# EAGLE schematic Main-DCDC Only (EAGLE 9.4.2)

## Sheet 1 of 2: Filter EMI PMP20694
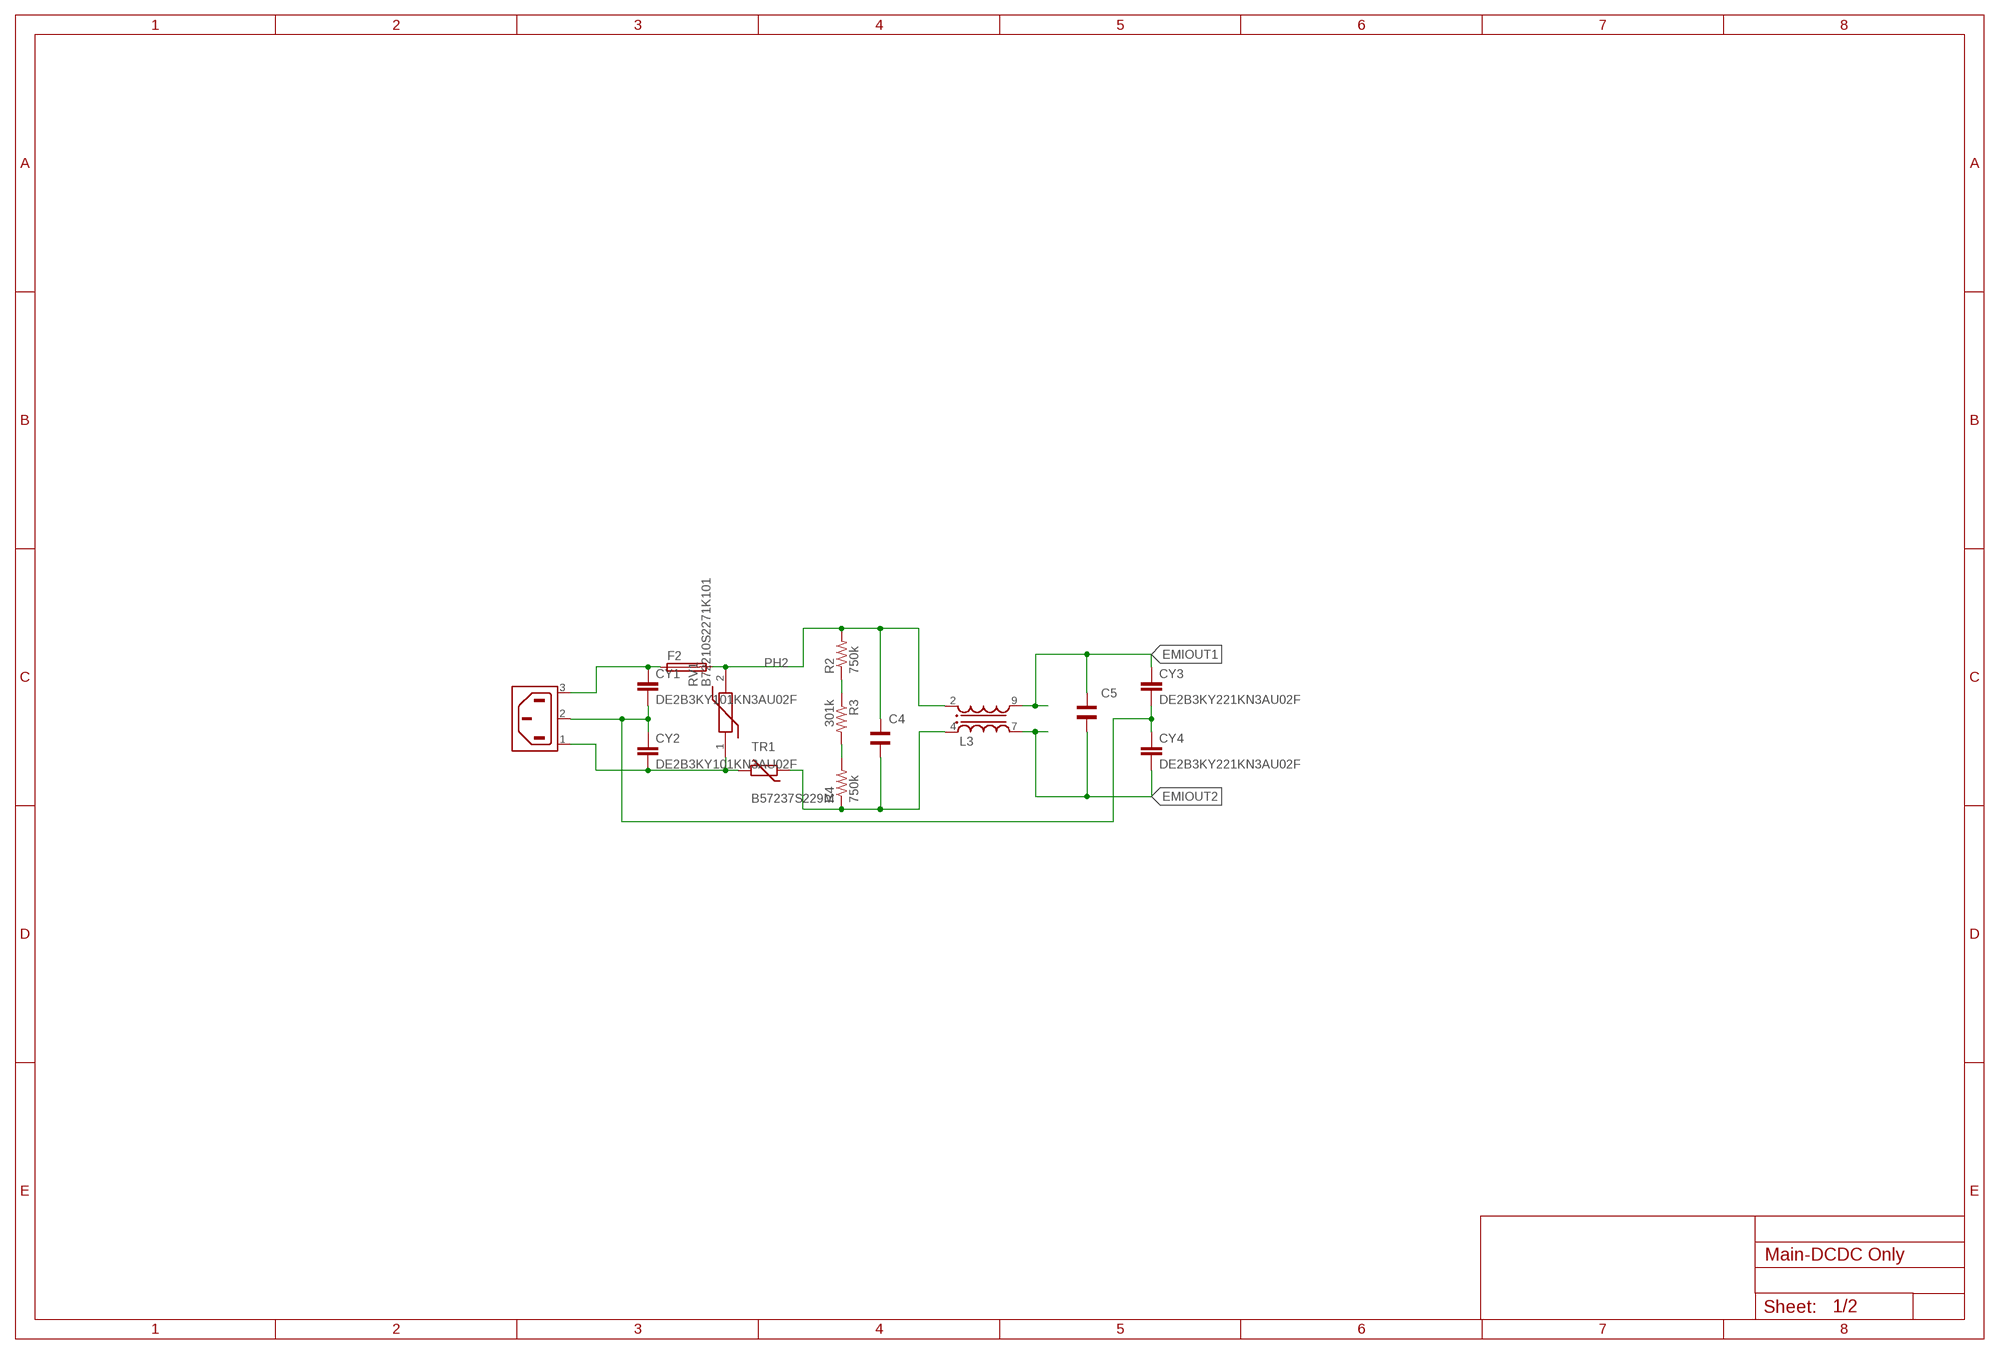
[diagram p0: schematic, sheet 1]

### Parts
C4  WCAP-FTXX_890334025039CS  [WCAP-FTXX_15X18X14X8]
C5  WCAP-FTXX_890334025039CS  [WCAP-FTXX_15X18X14X8]
CY1  DE2B3KY101KN3AU02F  CYYC7B5  [YC7B5]
CY2  DE2B3KY101KN3AU02F  CYYC7B5  [YC7B5]
CY3  DE2B3KY221KN3AU02F  CYYC7B5  [YC7B5]
CY4  DE2B3KY221KN3AU02F  CYYC7B5  [YC7B5]
F2  GSH15  [GSH15]
L3  WE-CMB_L_744824310  [WE-CMB_L]
R2  750k  R-US_R1206  [R1206]
R3  301k  R-US_R1206  [R1206]
R4  750k  R-US_R1206  [R1206]
RV1  B72210S2271K101  [B72210S2271K101]
TR1  B57237S229M  THERMISTOR_R-7,5  [R-7,5]
X1  6ESRM-P  [6ESRM-P]

### Nets
EMIOUT1: C5.2 CY3.1 L3.9
EMIOUT2: C5.1 CY4.2 L3.7
N$20: R2.1 R3.1
N$25: R3.2 R4.2
N$29: CY1.1 F2.1 X1.3(AC2)
N$38: CY2.2 RV1.1 TR1.2 X1.1(AC1)
N$40: C4.2 L3.4 R4.1 TR1.1
N$45: CY1.2 CY2.1 CY3.2 CY4.1 X1.2(SH)
PH2: C4.1 F2.2 L3.2 R2.2 RV1.2

## Sheet 2 of 2: Flyback
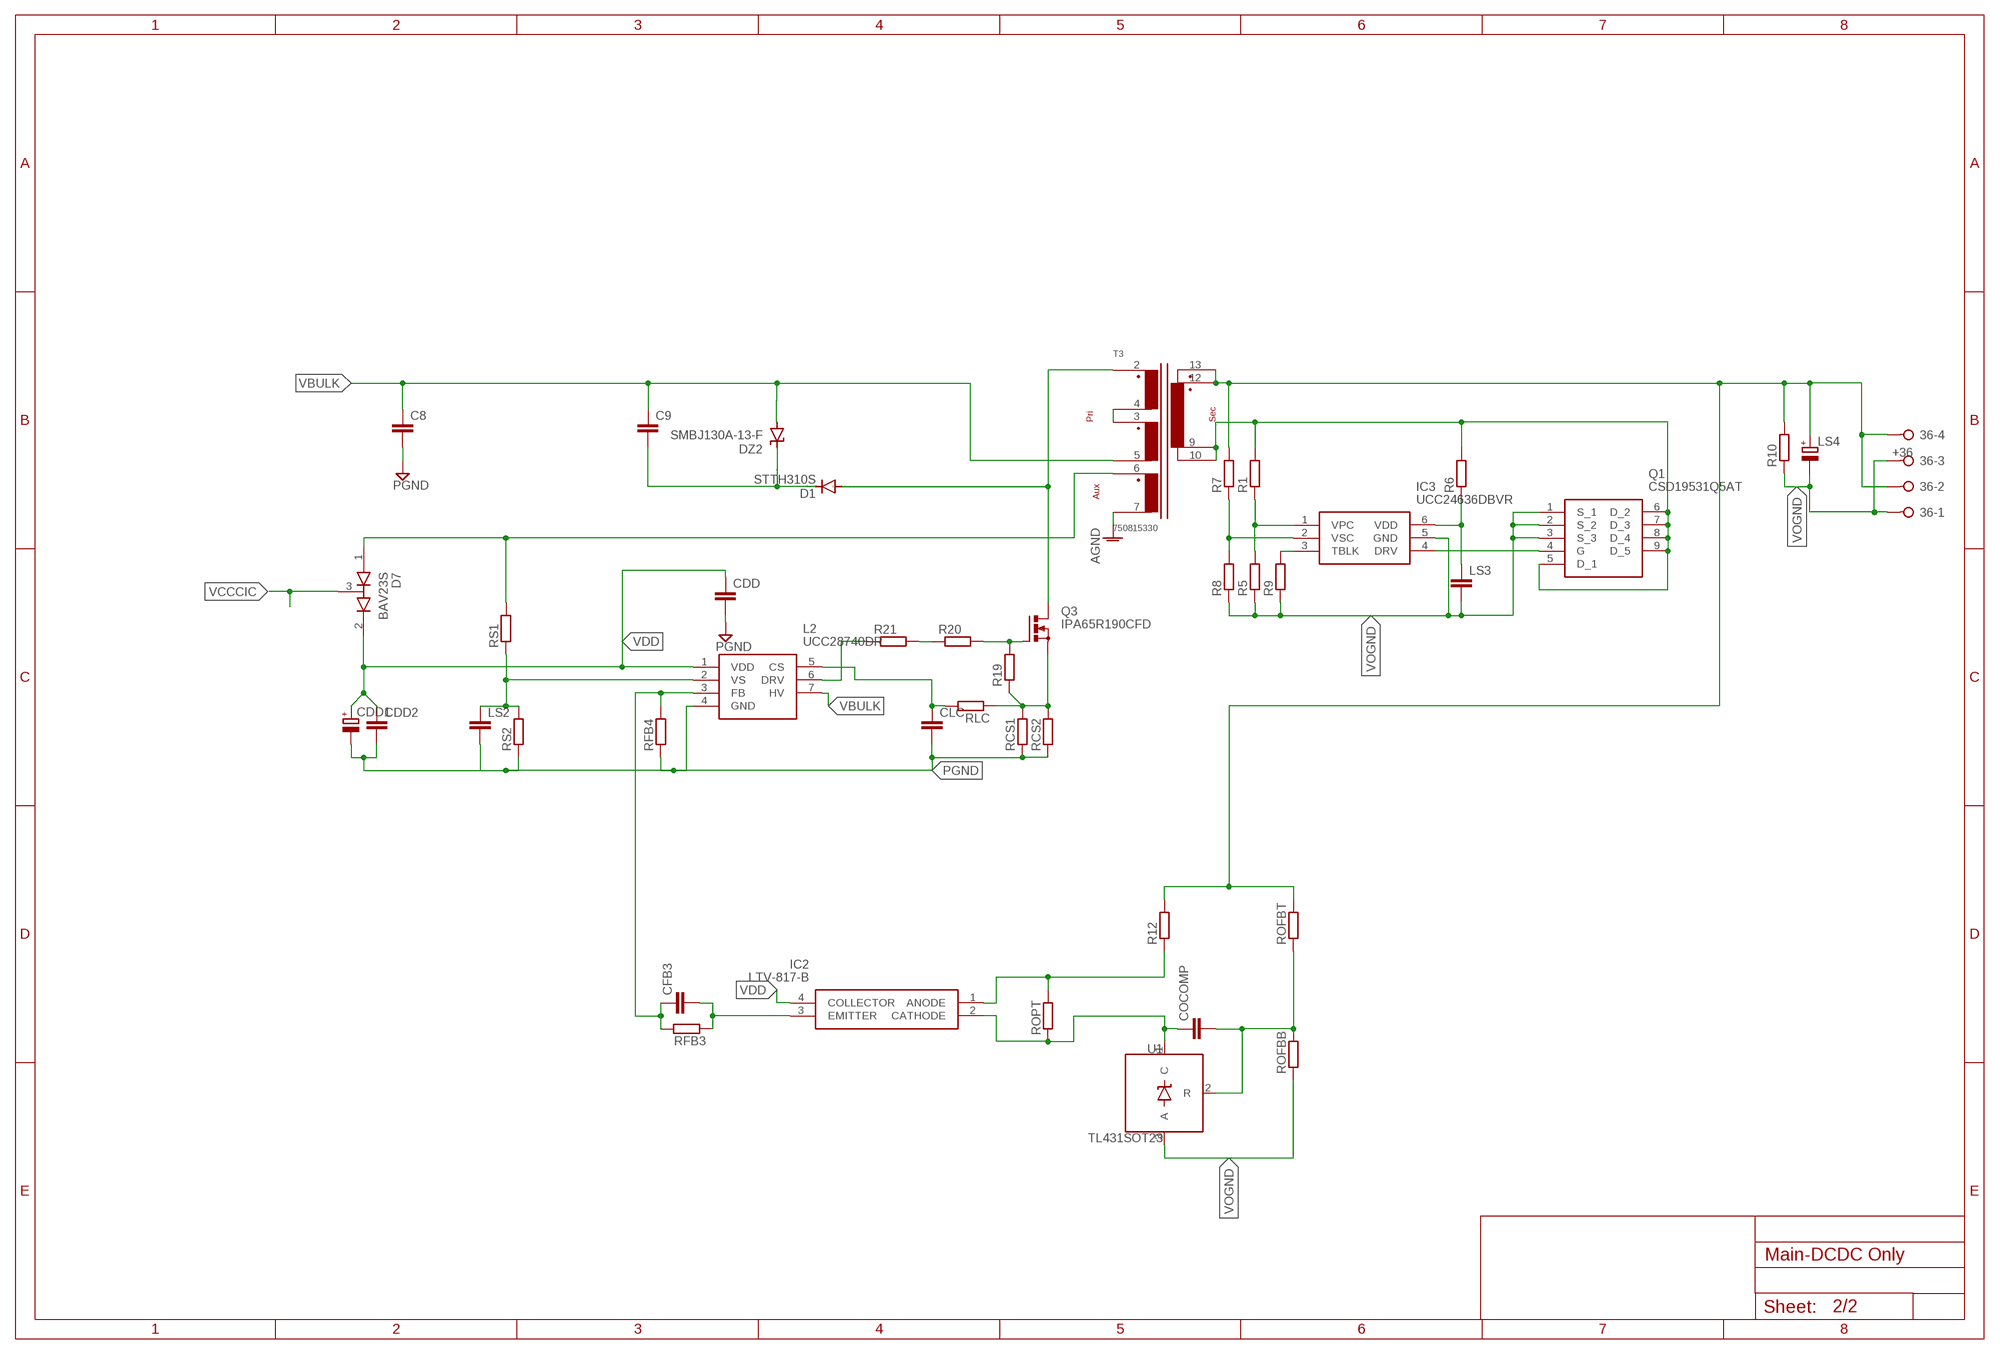
[diagram p1: schematic, sheet 2]

### Parts
36  +36  W237-04P  [W237-4P]
C8  C-EUC0805  [C0805]
C9  C-EUC0805  [C0805]
CDD  C-EUC0805  [C0805]
CDD1  CPOL-EUTT2D5  [TT2D5]
CDD2  C-EUC0805  [C0805]
CFB3  C-EUC0805  [C0805]
CLC  C-EUC0805  [C0805]
COCOMP  C-EUC0805  [C0805]
D1  STTH310S  DIODE-SMC  [SMC]
D7  BAV23S  [SOT95P230X110-3N]
DZ2  SMBJ130A-13-F  SUPPRESSOR-SMBJ  [SMBJ]
IC2  LTV-817-B  [DIP762W60P254L460H420Q4N]
IC3  UCC24636DBVR  [SOT95P280X145-6N]
L2  UCC28740DR  [D(R-PDSO-G7)]
LS2  C-EUC0805  [C0805]
LS3  C-EUC0805  [C0805]
LS4  CPOL-EU153CLV-1010  [153CLV-1010]
Q1  CSD19531Q5AT  [CSD19531Q5AT]
Q3  IPA65R190CFD  PMOSFET_NTO220BV  [TO220BV]
R1  R-EU_R0805  [R0805]
R5  R-EU_R0805  [R0805]
R6  R-EU_R0805  [R0805]
R7  R-EU_R0805  [R0805]
R8  R-EU_R0805  [R0805]
R9  R-EU_R0805  [R0805]
R10  R-EU_R0805  [R0805]
R12  R-EU_R0805  [R0805]
R19  R-EU_R0805  [R0805]
R20  R-EU_R0805  [R0805]
R21  R-EU_R0805  [R0805]
RCS1  R-EU_R0805  [R0805]
RCS2  R-EU_R0805  [R0805]
RFB3  R-EU_R0805  [R0805]
RFB4  R-EU_R0805  [R0805]
RLC  R-EU_R0805  [R0805]
ROFBB  R-EU_R0805  [R0805]
ROFBT  R-EU_R0805  [R0805]
ROPT  R-EU_R0805  [R0805]
RS1  R-EU_R0805  [R0805]
RS2  R-EU_R0805  [R0805]
T3  750815330  [EE25/13/7_THT_H_14PIN_(5644)]
U1  TL431SOT23  [SOT23-3]

### Nets
N$5: COCOMP.2 ROFBB.2 ROFBT.1 U1.2(R)
N$6: CFB3.2 IC2.3(EMITTER) RFB3.1
N$8: T3.3 T3.4
N$12: D7.1 RS1.2 T3.6
N$15: IC2.1(ANODE) R12.1 ROPT.2
N$17: CFB3.1 L2.3(FB) RFB3.2 RFB4.2
N$18: COCOMP.1 IC2.2(CATHODE) ROPT.1 U1.1(C)
N$19: 36.2 36.4 LS4.+ R7.2 R10.2 R12.2 ROFBT.2 T3.12 T3.13
N$22: IC3.4(DRV) Q1.4(G)
N$27: L2.2(VS) LS2.1 RS1.1 RS2.2
N$30: Q1.5(D_1) Q1.6(D_2) Q1.7(D_3) Q1.8(D_4) Q1.9(D_5) R1.2 R6.2 T3.9 T3.10
N$43: R20.1 R21.2
N$44: Q3.G R19.2 R20.2
N$50: C9.2 D1.C DZ2.C
N$52: D1.A Q3.D T3.2
N$CS: CLC.1 L2.5(CS) RLC.2
N$DRV: L2.6(DRV) R21.1
N$TBK: IC3.3(TBLK) R9.2
N$VODD: IC3.6(VDD) LS3.1 R6.1
N$VPC: IC3.1(VPC) R1.1 R5.2
N$VSC: IC3.2(VSC) R7.1 R8.2
PGND: C8.2 CDD1.- CDD2.2 CDD.2 CLC.2 L2.4(GND) LS2.2 RCS1.1 RCS2.1 RFB4.1 RS2.1 T3.7 ; supply symbol labelled AGND
TOISENSE: Q3.S R19.1 RCS1.2 RCS2.2 RLC.1
VBULK: C8.1 C9.1 DZ2.A L2.7(HV) T3.5
VCCCIC: D7.3
VDD: CDD1.+ CDD2.1 CDD.1 D7.2 IC2.4(COLLECTOR) L2.1(VDD)
VOGND: 36.1 36.3 IC3.5(GND) LS3.2 LS4.- Q1.1(S_1) Q1.2(S_2) Q1.3(S_3) R5.1 R8.1 R9.1 R10.1 ROFBB.1 U1.3(A)

## Library data of the parts
36 = con-wago-508:W237-04P: WAGO SREW CLAMP; OC_FARNELL: unknown; OC_NEWARK: unknown
C4 C5 = Wurth_Elektronik_Passive_Capacitors_rev18b:WCAP-FTXX: WCAP-FTXX Film Capacitors Characteristics MKP,Metallized Polypropylene Film Recommended soldering :Wave Operating temperature:-40 °C to +105 °C Climate category: 40/105/56/B Self-healing properties Certificates: cULus, CQC, VDE Applications Safety applications Filter Power supplies Electrical property <http://katalog.we-online.de/media/images/eisos/WCAP-FTXX_pf2.jpg> Details see: http://katalog.we-online.de/pbs/datasheet/890334022007.pdf Created: 2014-09-15 2014 (C) Wurth Elektronik; WE-NUMBER: 890334025039CS/0,47uF
C8 C9 CDD CDD2 CFB3 CLC COCOMP LS2 LS3 = rcl:C-EU: CAPACITOR, European symbol; SPICEPREFIX: C
CDD1 LS4 = rcl:CPOL-EU: POLARIZED CAPACITOR, European symbol; SPICEPREFIX: C
CY1-CY4 = rcl:CY: Y CAPACITOR for power line; SPICEPREFIX: C
D1 = diode:DIODE-: DIODE
D7 = SamacSys_Parts:BAV23S: BAV23S, Rectifier Diode, Switching 0.225A max, 250V Dual, 3-Pin, TO-236AB Source: Datasheet <http://www.nxp.com/documents/data_sheet/BAV23_SER.pdf>; DESCRIPTION: BAV23S, Rectifier Diode, Switching 0.225A max, 250V Dual, 3-Pin, TO-236AB; HEIGHT: 1.1mm; MANUFACTURER_NAME: Nexperia; MANUFACTURER_PART_NUMBER: BAV23S; MOUSER_PART_NUMBER: N/A; MOUSER_PRICE-STOCK: https://www.mouser.com/Search/Refine.aspx?Keyword=N%2FA
DZ2 = diode:SUPPRESSOR-: Suppressor diode
F2 = fuse:GSH15: FUSE HOLDER grid 15mm, 19649 Wickmann; MPN: 64900001039; OC_FARNELL: 1271673; OC_NEWARK: 02P0318
IC2 = SamacSys_Parts:LTV-817-B: Lite-On LTV-817-B DC Input Transistor Output Optocoupler, Through Hole, 4-Pin PDIP Source: Datasheet <http://optoelectronics.liteon.com/upload/download/DS-70-96-0016/LTV-8X7 series 201610 .pdf>; DESCRIPTION: Lite-On LTV-817-B DC Input Transistor Output Optocoupler, Through Hole, 4-Pin PDIP; HEIGHT: 4.2mm; MANUFACTURER_NAME: Lite-On; MANUFACTURER_PART_NUMBER: LTV-817-B; MOUSER_PART_NUMBER: N/A; MOUSER_PRICE-STOCK: https://www.mouser.com/Search/Refine.aspx?Keyword=N%2FA; RS_PART_NUMBER: 6912145P; RS_PRICE-STOCK: http://uk.rs-online.com/web/p/products/6912145P
IC3 = SamacSys_Parts:UCC24636DBVR: Synchronous Rectifier Controller With Ultra-Low Standby Current Source: Datasheet <http://www.ti.com/lit/gpn/ucc24636>; DESCRIPTION: Synchronous Rectifier Controller With Ultra-Low Standby Current; HEIGHT: 1.45mm; MANUFACTURER_NAME: Texas Instruments; MANUFACTURER_PART_NUMBER: UCC24636DBVR; MOUSER_PART_NUMBER: 595-UCC24636DBVR; MOUSER_PRICE-STOCK: https://www.mouser.com/Search/Refine.aspx?Keyword=595-UCC24636DBVR
L2 = SamacSys_Parts:UCC28740DR: Constant-Voltage, Constant-Current Flyback Controller Using Opto-Coupler Feedback Source: Datasheet <http://www.ti.com/lit/gpn/ucc28740>; DESCRIPTION: Constant-Voltage, Constant-Current Flyback Controller Using Opto-Coupler Feedback; HEIGHT: mm; MANUFACTURER_NAME: Texas Instruments; MANUFACTURER_PART_NUMBER: UCC28740DR; MOUSER_PART_NUMBER: 595-UCC28740DR; MOUSER_PRICE-STOCK: https://www.mouser.com/Search/Refine.aspx?Keyword=595-UCC28740DR
L3 = Wurth_Elektronik_Passive_rev18f:WE-CMB: WE-CMB Common Mode Power Line Choke Characteristics With this product you can achieve high suppression of asymmetric interferences even at low frequency ranges Broadband filtering because of low capacitance winding technique Very compact design Highest possible current with small sizes High interference compression asymmetric interference rates also at low frequence range Custom designs on request Operating temperature: –40 ºC to +125 ºC Applications Power electronics Power line input and output filter For filtering of devices without a stable ground connection Radio interference suppression in motors Suppression of common mode noise <http://katalog.we-online.de/media/images/v2/Family_WE-CMB_XS-XXL.jpg> Details see: http://katalog.we-online.de/en/pbs/WE-CMB? Updated by Dan Xu 2014-06-30 2014 (C) Wurth Elektronik; WE-NUMBER: 744824310/10mH
Q1 = SamacSys_Parts:CSD19531Q5AT: Texas Instruments CSD19531Q5AT N-channel MOSFET Transistor, 110 A, 100 V, 8-Pin VSON Source: Datasheet <http://www.ti.com/general/docs/lit/getliterature.tsp?genericPartNumber=CSD19531Q5A&&fileType=pdf>; DESCRIPTION: Texas Instruments CSD19531Q5AT N-channel MOSFET Transistor, 110 A, 100 V, 8-Pin VSON; HEIGHT: 1mm; MANUFACTURER_NAME: Texas Instruments; MANUFACTURER_PART_NUMBER: CSD19531Q5AT; MOUSER_PART_NUMBER: 595-CSD19531Q5AT; MOUSER_PRICE-STOCK: https://www.mouser.com/Search/Refine.aspx?Keyword=595-CSD19531Q5AT; RS_PART_NUMBER: 8239259P; RS_PRICE-STOCK: http://uk.rs-online.com/web/p/products/8239259P
Q3 = transistor-power:PMOSFET_N: Power MOSFET N-Channel
R1 R5-R10 R12 R19-R21 RCS1 RCS2 RFB3 RFB4 RLC ROFBB ROFBT ROPT RS1 RS2 = rcl:R-EU_: RESISTOR, European symbol; SPICEPREFIX: R
R2-R4 = rcl:R-US_: RESISTOR, American symbol; SPICEPREFIX: R
RV1 = SamacSys_Parts:B72210S2271K101: EPCOS - B72210S2271K101 - VARISTOR, MOV, 710V, DISC 10MM Source: Datasheet <https://componentsearchengine.com/Datasheets/1/B72210S2271K101.pdf>; DESCRIPTION: EPCOS - B72210S2271K101 - VARISTOR, MOV, 710V, DISC 10MM; HEIGHT: 15mm; MANUFACTURER_NAME: EPCOS; MANUFACTURER_PART_NUMBER: B72210S2271K101; MOUSER_PART_NUMBER: 871-B72210S2271K101; MOUSER_PRICE-STOCK: https://www.mouser.com/Search/Refine.aspx?Keyword=871-B72210S2271K101
T3 = wurth_electronics_midcom_inc_v2-1:750815330: Package Style: EE25/13/7 Mounting: THT Pins: 14 pins Bobbin: 070-5644 Best pinouts for production vary per application. Please contact Wurth Electronics Midcom, Inc. for assistance with your custom design. Website: Wurth Electronics Midcom <http://www.we-online.com/midcom> Contact us Wurth Electronics Midcom, Inc. 121 Airport Dr. Watertown, SD 57201 Phone: (605) 886-4385 Fax: (605) 886-4486 E-Mail: midcom@we-online.com
TR1 = discrete:THERMISTOR_: Thermo Resistor
U1 = SparkFun-DiscreteSemi:TL431: TL431- Voltage Reference Precision Programmable Shunt Regulator Diode Datasheet <https://cdn.sparkfun.com/datasheets/Components/General%20IC/TL431-D.pdf> SparkFun Products: TL431-Voltage Reference PTH <https://www.sparkfun.com/products/11078> SparkFun Uh-Oh Battery Level Indicator <https://www.sparkfun.com/products/11087>
X1 = con-tycoelectronics:6ESRM-P: AC Connector 120/250 VAC Source: http://catalog.tycoelectronics.com .. ENG_DS_1654001_1099_SR_0406.pdf; MF: TYCO ELECTRONICS; MPN: 6ESRM-P; OC_FARNELL: unknown; OC_NEWARK: 87F1821